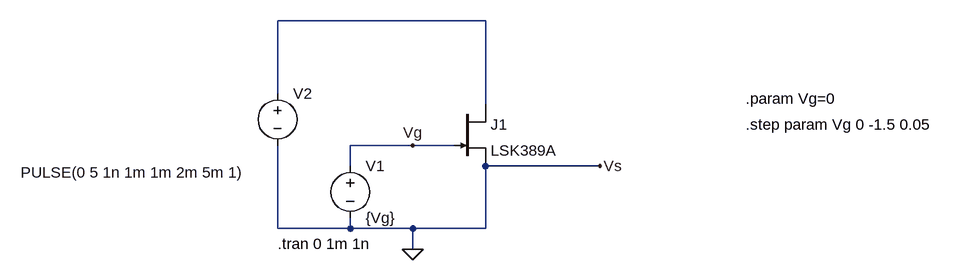
[diagram p0: schematic LSK389.asc]
LSK389.asc, the LTspice schematic file:
Version 4
SHEET 1 964 680
WIRE 256 -32 -64 -32
WIRE -64 80 -64 -32
WIRE 256 96 256 -32
WIRE 144 160 48 160
WIRE 208 160 144 160
WIRE 48 192 48 160
WIRE 432 192 256 192
WIRE -64 288 -64 160
WIRE 48 288 48 272
WIRE 48 288 -64 288
WIRE 144 288 48 288
WIRE 256 288 256 192
WIRE 256 288 144 288
WIRE 144 320 144 288
FLAG 144 320 0
FLAG 432 192 Vs
FLAG 144 160 Vg
SYMBOL njf 208 96 R0
SYMATTR InstName J1
SYMATTR Value LSK389A
SYMBOL voltage -64 64 R0
WINDOW 3 -395 138 Left 2
WINDOW 123 0 0 Left 0
WINDOW 39 0 0 Left 0
SYMATTR InstName V2
SYMATTR Value PULSE(0 5 1n 1m 1m 2m 5m 1)
SYMBOL voltage 48 176 R0
WINDOW 123 0 0 Left 0
WINDOW 39 0 0 Left 0
SYMATTR InstName V1
SYMATTR Value {Vg}
TEXT -64 312 Left 2 !.tran 0 1m 1n
TEXT 656 88 Left 2 !.param Vg=0
TEXT 656 128 Left 2 !.step param Vg 0 -1.5 0.05

The netlist it stands for:
* LSK389.asc
J1 N001 Vg 0 LSK389A
V2 N001 0 PULSE(0 5 1n 1m 1m 2m 5m 1)
V1 Vg 0 {Vg}
.model NJF NJF
.model PJF PJF
.lib standard.jft
.tran 0 1m 1n
.param Vg=0
.step param Vg 0 -1.5 0.05
.backanno
.end